# EAGLE design WiFi_RGB_Lights (EAGLE 7.7.0)
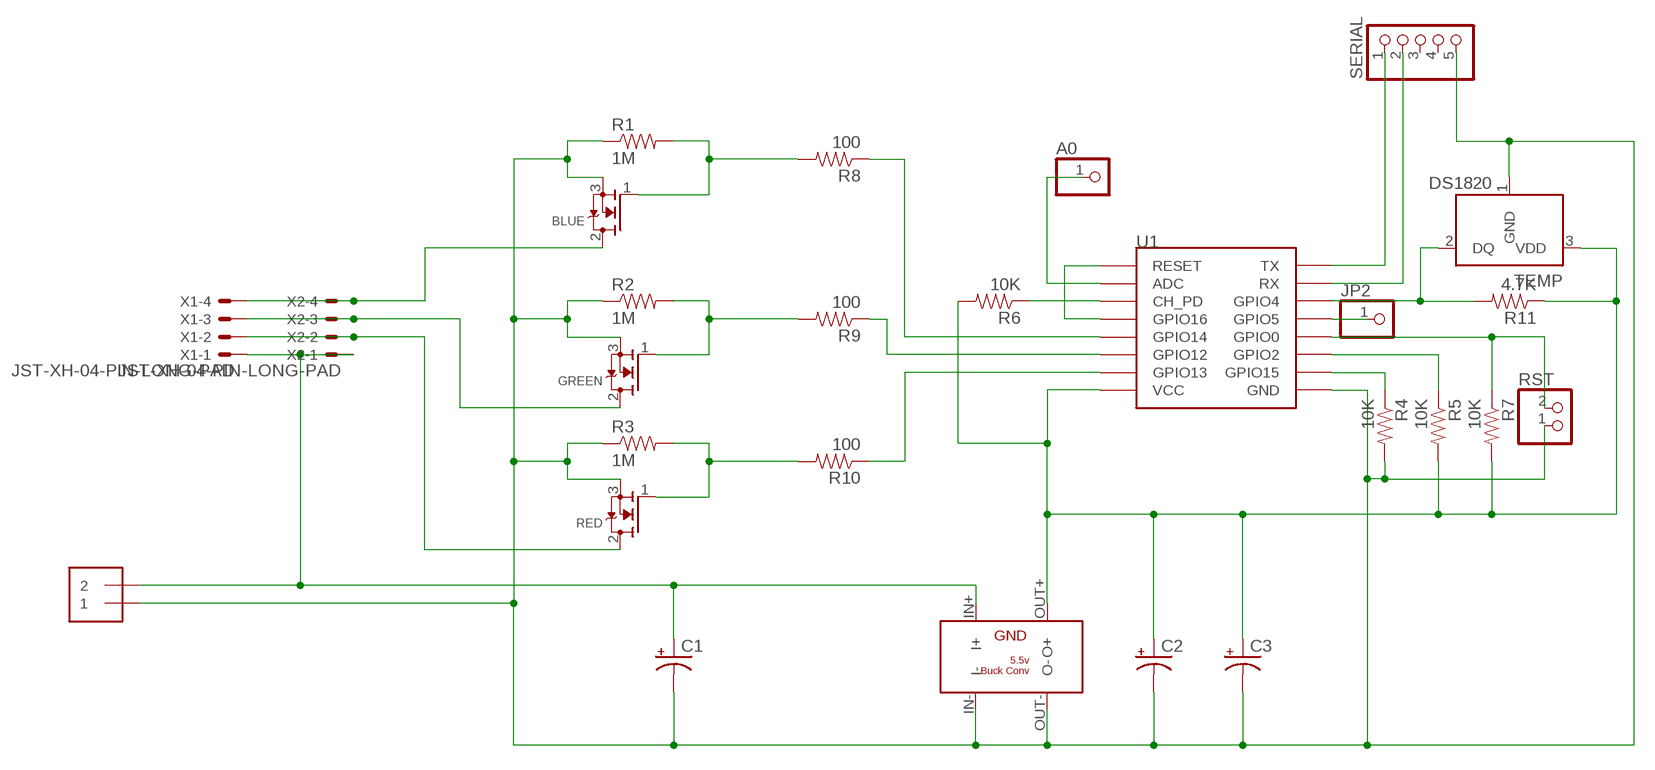
[diagram p0: schematic, sheet 1]

## Parts
3.3V  BUCK_CONV_5.5V  [BUCK_CONV]
A0  PINHD-1X1  [1X01]
BLUE  MOSFET-NGDS_TO220V  [TO220V]
C1  CPOL-USE5-8.5  [E5-8,5]
C2  CPOL-USE2.5-6  [E2,5-6]
C3  CPOL-USE2.5-6  [E2,5-6]
GREEN  MOSFET-NGDS_TO220V  [TO220V]
JP2  PINHD-1X1  [1X01]
PWR  5MM_TERMINAL_BLOCK  [5MM_TERMINAL_BLOCK]
R1  1M  RESISTOR1206  [1206]
R2  1M  RESISTOR1206  [1206]
R3  1M  RESISTOR1206  [1206]
R4  10K  RESISTOR1206  [1206]
R5  10K  RESISTOR1206  [1206]
R6  10K  RESISTOR1206  [1206]
R7  10K  RESISTOR1206  [1206]
R8  100  RESISTOR0805-RES  [0805]
R9  100  RESISTOR0805-RES  [0805]
R10  100  RESISTOR0805-RES  [0805]
R11  4.7K  RESISTOR1206  [1206]
RED  MOSFET-NGDS_TO220V  [TO220V]
RST  JST_2PIN-THM  [JST-PH-2-THM]
SERIAL  PINHD-1X5  [1X05]
TEMP  DS1820  [TO-92]
U1  ESP12  [ESP12]
X1  JST-XH-04-PIN-LONG-PAD  [JST-XH-04-PACKAGE-LONG-PAD]
X2  JST-XH-04-PIN-LONG-PAD  [JST-XH-04-PACKAGE-LONG-PAD]

## Nets
3V: 3.3V.OUT+(O+) C2.+ C3.+ R5.2 R6.2 R7.2 R11.1 TEMP.3(VDD) U1.VCC
12V: 3.3V.IN+(I+) C1.+ PWR.2 X1.1 X2.1
GND: 3.3V.IN-(I-) 3.3V.OUT-(O-) BLUE.3(S) C1.- C2.- C3.- GREEN.3(S) PWR.1 R1.1 R2.1 R3.1 R4.2 RED.3(S) RST.1 SERIAL.5 TEMP.1(GND) U1.GND
N$1: GREEN.1(G) R2.2 R9.2
N$2: U1.GPIO16 U1.RESET
N$3: R6.1 U1.CH_PD
N$4: R10.1 U1.GPIO13
N$5: R9.1 U1.GPIO12
N$6: R8.1 U1.GPIO14
N$7: A0.1 U1.ADC
N$8: R4.1 U1.GPIO15
N$9: BLUE.1(G) R1.2 R8.2
N$10: R5.1 U1.GPIO2
N$11: R7.1 RST.2 U1.GPIO0
N$12: RED.2(D) X1.2 X2.2
N$13: R11.2 TEMP.2(DQ) U1.GPIO4
N$14: JP2.1 U1.GPIO5
N$15: SERIAL.2 U1.RX
N$16: SERIAL.1 U1.TX
N$17: R3.2 R10.2 RED.1(G)
N$19: GREEN.2(D) X1.3 X2.3
N$20: BLUE.2(D) X1.4 X2.4
Unconnected: SERIAL.3 SERIAL.4

## Library data of the parts
3.3V = Jon_SelfMade:BUCK_CONV_5.5V
A0 JP2 = adafruit:PINHD-1X1: Pin header 1x1 for 0.1" spacing With round pins
BLUE GREEN RED = adafruit:MOSFET-N: N-Channel Mosfet 2N7002E - 60V 260mA SOT23 [Digikey: 2N7002ET1GOSTR-ND] - REEL BSH103 - 30V 850mA SOT23 [Digikey: 568-5013-1-ND]
C1-C3 = adafruit:CPOL-US: POLARIZED CAPACITOR, American symbol
PWR = Jon_SelfMade:5MM_TERMINAL_BLOCK
R1-R11 = SparkFun-Passives:RESISTOR: Resistor Basic schematic elements and footprints for 0603, 1206, and PTH resistors.
RST = adafruit:JST_2PIN: JST 2-Pin Connectors of various flavors SMT-RA (S2B-PH-SM4) 4UConnector #17311 SMT (B2B-PH-SM4) THM-RA (S2B-PH) THM (B2B-PH)
SERIAL = pinhead:PINHD-1X5: PIN HEADER
TEMP = DS1820:DS1820: DS1820 - 1-Wire Digital Thermometer
U1 = esp8266modules:ESP12: ESP8266 Wifi module 12
X1 X2 = Rembrandt Electronics - JST XH Connectors v1-0:JST-XH-04-PIN: JST XH Connector 2 Pin Wire to board connector. Pitch: 2,54 mm, (0.100") Number of pins: 4 Created by Rembrandt Electronics www.rembrandtelectronics.com

## Board
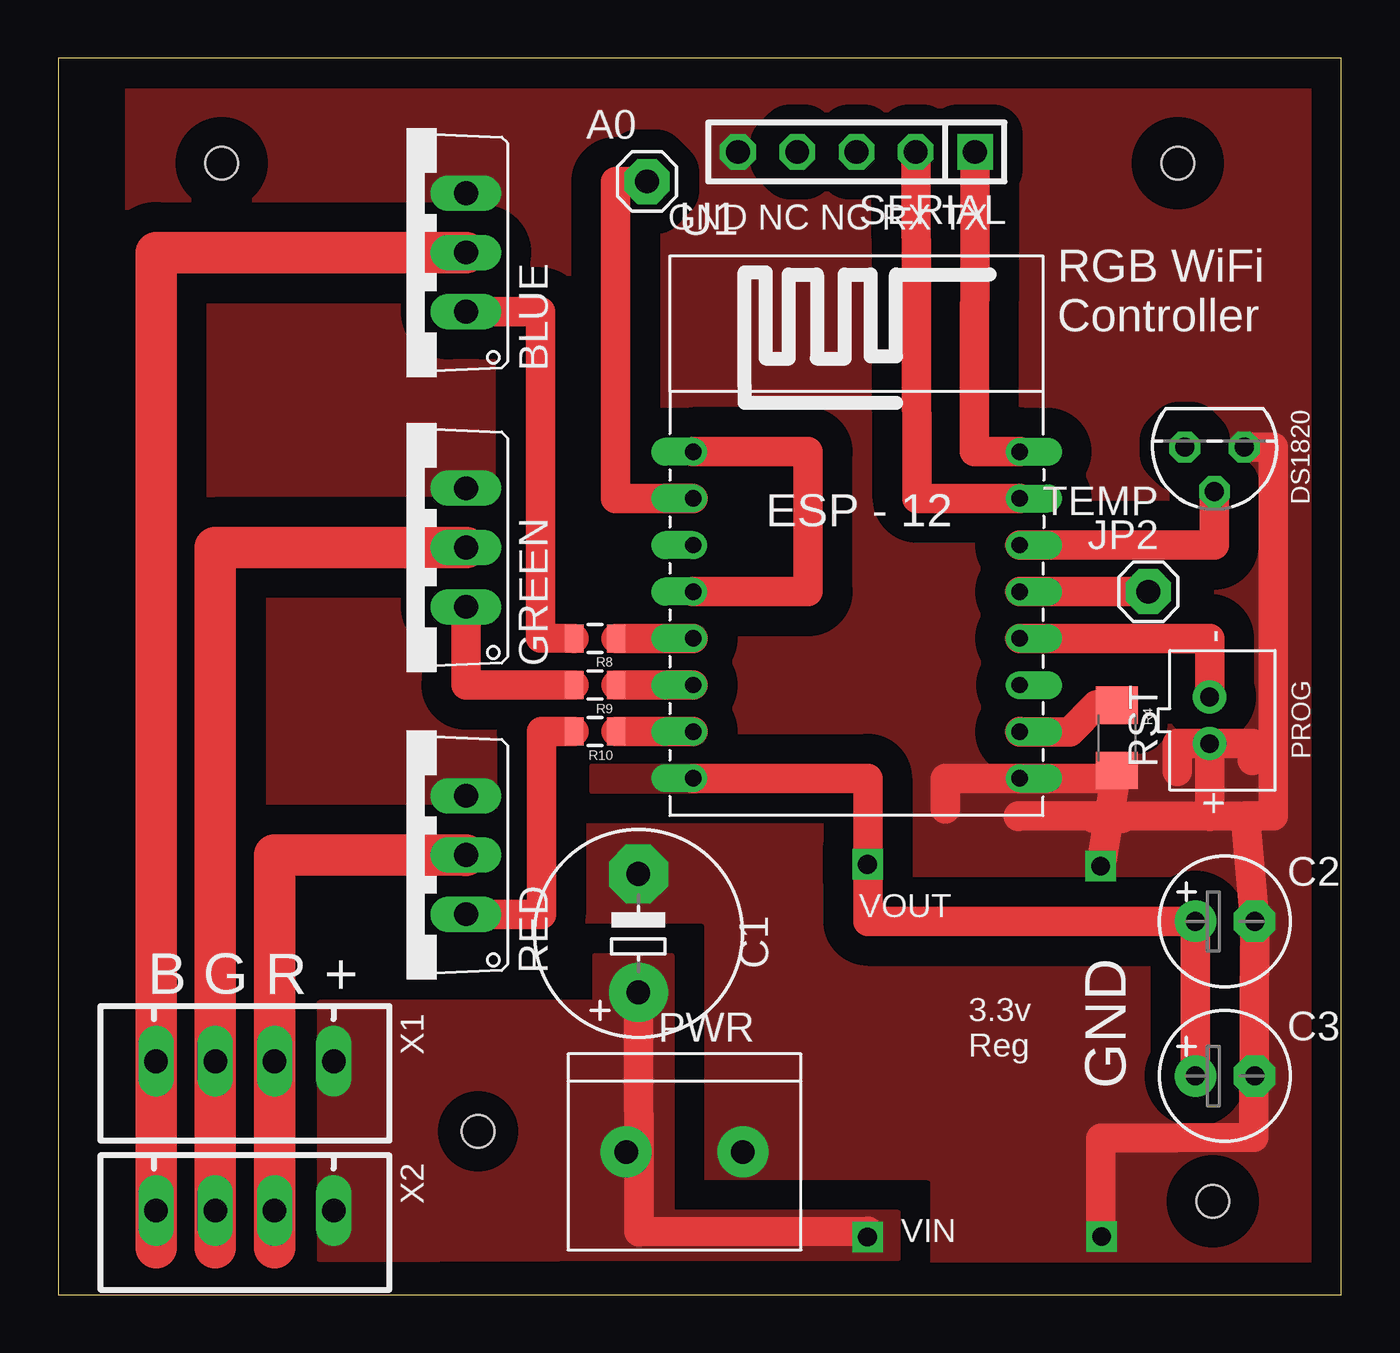
[diagram p1: board, top side]
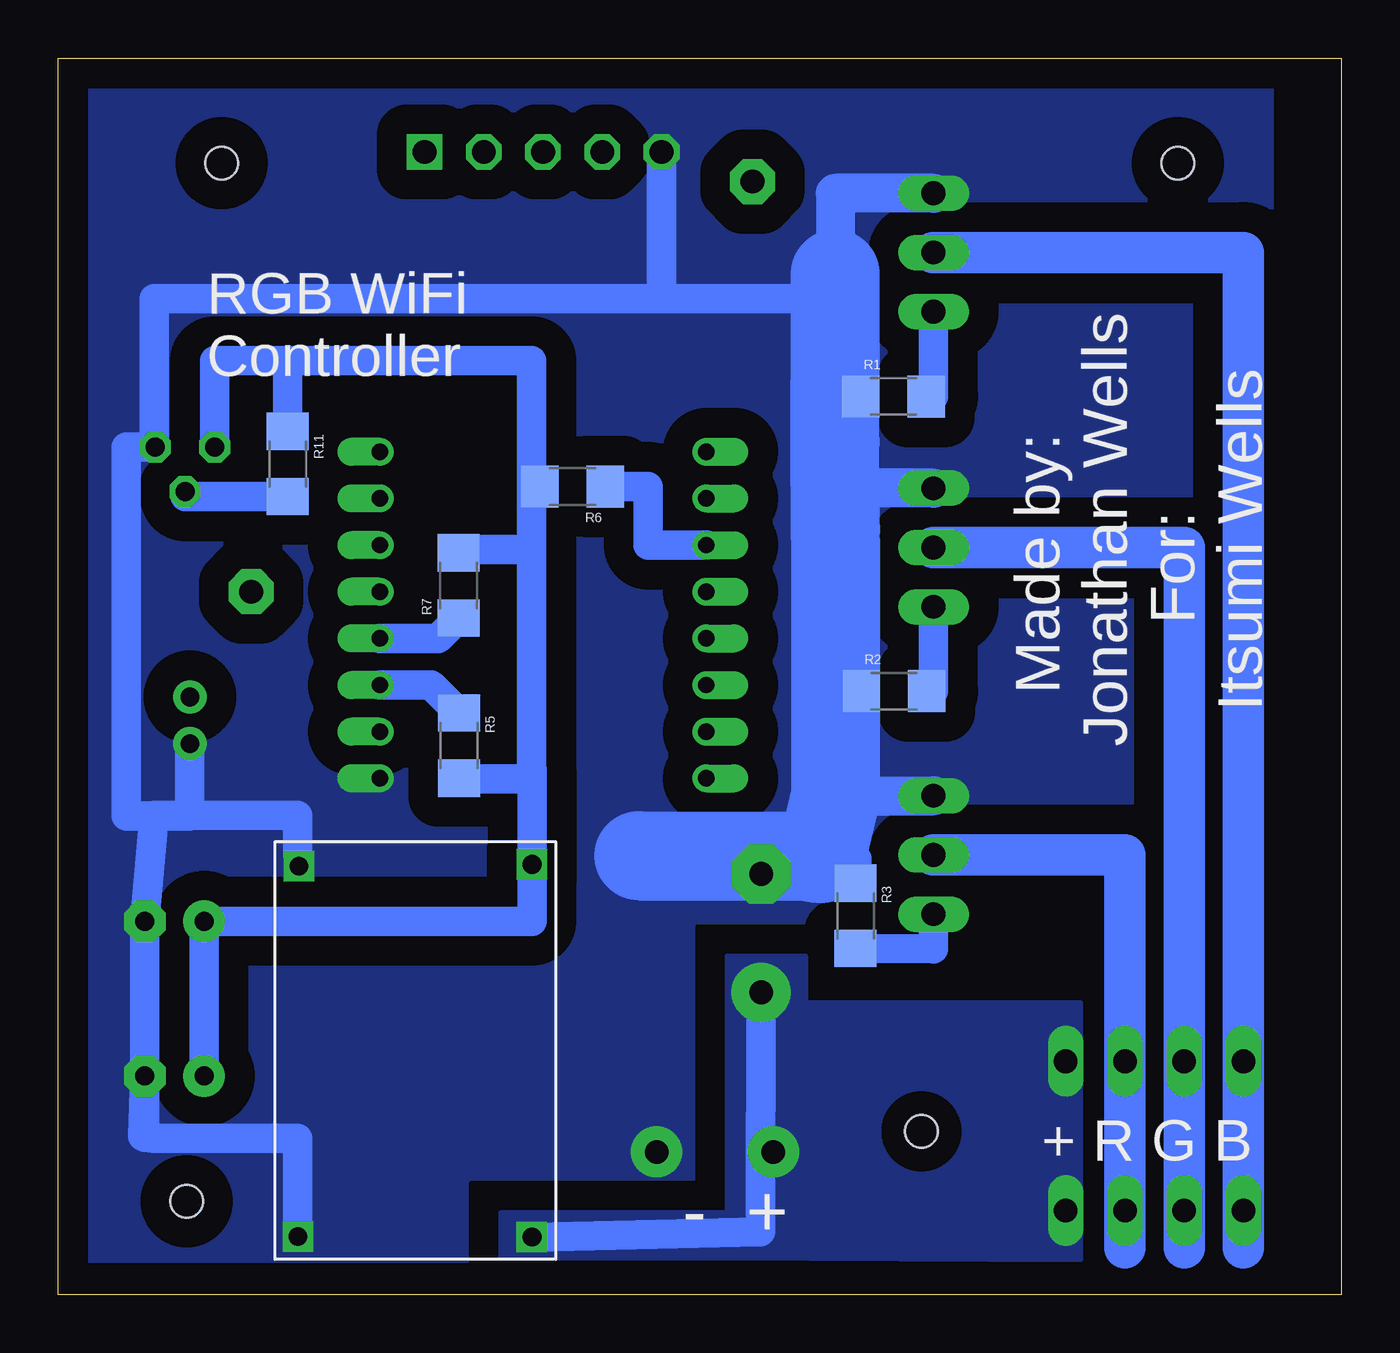
[diagram p2: board, bottom side, seen from below]

Size 55 x 53 mm. Coordinates in mm from the lower left corner, seen from the top.
Outline: 0,0 55,0 55,53 0,53 0,0
Copper layers (1*16): Top 0.035mm / dielectric 1.5mm / Bottom 0.035mm
Design rules "default": minimum track width 10mil, minimum drill 24mil, track to track 8mil, track to pad 8mil, pad to pad 8mil, via to via 8mil, smd to smd 8mil, copper to edge 40mil, drill to drill 8mil, minimum pad ring 10mil, minimum via ring 8mil, stop-mask expansion 4mil, vias tented up to drill 0mil, thermal gap 10mil
Holes 1.4 mm at 49.5,4 48,48.5 7,48.5 18,7

### Footprints (pad centres in the part's own frame; a part is rotated, then mirrored left to right if it is on the bottom)
BUCK_CONV = drill 0.8 square: IN+ -8.04,-5.08; IN- -8.01,4.96; OUT+ 7.94,-5.08; OUT- 7.87,4.91
1X01 = drill 1.016 pad 1.93 octagon: 1 0,0
TO220V = drill 1.016 long: 1 -2.54,-2.54; 2 0,-2.54; 3 2.54,-2.54
E5-8,5 = drill 1.016 pad 2.54: + -2.54,0 | drill 1.016 pad 2.54 octagon: - 2.54,0
E2,5-6 = drill 0.813 pad 1.778: + -1.27,0 | drill 0.813 pad 1.778 octagon: - 1.27,0
5MM_TERMINAL_BLOCK = drill 1 pad 2.184: 1 2.5,0; 2 -2.5,0
1206 = smd 1.6 x 1.8: 1 -1.4,0; 2 1.4,0
0805 = smd 0.8 x 1.2: 1 -0.9,0; 2 0.9,0
JST-PH-2-THM = drill 0.8 pad 1.422: 1 1,0; 2 -1,0
1X05 = drill 1.016 square: 1 -5.08,0 | drill 1.016 octagon: 2 -2.54,0; 3 0,0; 4 2.54,0; 5 5.08,0
TO-92 = drill 0.813 pad 1.27 octagon: 1 -1.27,0; 2 0,1.905; 3 1.27,0
ESP12 = drill 0.7 offset: ADC -7.1,3.8; CH_PD -7.1,1.8; GND 6.9,-8.2; GPIO0 6.9,-2.2; GPIO2 6.9,-4.2; GPIO4 6.9,1.8; GPIO5 6.9,-0.2; GPIO12 -7.1,-4.2; GPIO13 -7.1,-6.2; GPIO14 -7.1,-2.2; GPIO15 6.9,-6.2; GPIO16 -7.1,-0.2; RESET -7.1,5.8; RX 6.9,3.8; TX 6.9,5.8; VCC -7.1,-8.2
JST-XH-04-PACKAGE-LONG-PAD = drill 1.016 long: 1 -3.81,0; 2 -1.27,0; 3 1.27,0; 4 3.81,0

### Placement (x,y rotation side)
3.3V  39.77,10.5 90 bottom
A0  25.24,47.72 0 top
BLUE  14.94,44.67 90 top
C1  24.87,15.49 90 top
C2  50.02,16 0 top
C3  50.02,9.37 0 top
GREEN  14.94,32.02 90 top
JP2  46.73,30.13 0 top
PWR  26.84,6.11 0 top
R1  19.2,38.51 0 bottom
R2  19.17,25.86 0 bottom
R3  20.82,16.24 270 bottom
R4  45.38,23.87 270 top
R5  37.81,23.54 270 bottom
R6  32.95,34.64 180 bottom
R7  37.84,30.4 90 bottom
R8  23.02,28.13 180 top
R9  23.02,26.12 180 top
R10  23.02,24.13 180 top
R11  45.16,35.61 270 bottom
RED  14.94,18.84 90 top
RST  49.36,24.62 270 top
SERIAL  34.22,48.99 180 top
TEMP  49.57,36.33 180 top
U1  34.32,30.33 0 top
X1  8,10 180 top
X2  8,3.6 180 top

### Tracks (layer width: path | path; a pad name or v marks a point on that pad's centre or on a via)
3V
  Top 1.27: U1.VCC 34.7,22.13 34.7,18.69 | C3.+ C2.+ | C2.+ 48.87,16 | C2.+ 34.7,16 34.7,18.69 | 34.7,18.69 3.3V.OUT+
  Bottom 1.27: 34.7,34.41 34.7,31.95 | 34.7,31.95 34.7,22.11 | R6.2 34.35,34.41 34.7,34.41 | R7.2 37.84,31.95 34.7,31.95 | R5.2 37.81,22.11 34.7,22.11 | TEMP.3 48.3,40.03 45.16,40.03 | 45.16,40.03 34.7,40.03 34.7,34.41 | R11.1 45.16,40.03 | 34.7,22.11 34.69,22.52 3.3V.OUT+ 34.69,16 48.88,16 | C3.+ C2.+
  pour Top (no thermals): 27.33,21.58 22.9,21.58 22.9,22.64 27.33,22.64
12V
  Top 1.27: C1.+ 24.91,2.68 34.7,2.71
  Bottom 1.27: C1.+ 24.89,2.68 3.3V.IN+
  pour Top (no thermals): 11.2,1.51 26.63,1.56 36,1.56 36,3.5 26.3,3.5 26.3,14.5 23,14.5 23,12.5 11.2,12.5
  pour Bottom (no thermals): 11.2,1.5 26.66,1.56 36,1.56 36,3.5 26.3,3.5 26.3,14.5 23,14.5 23,12.5 11.2,12.5
GND
  Top 1.27: 49.37,20.49 45.59,20.52 | 45.59,20.52 44.39,20.52 | 44.39,20.52 41.17,20.52 41.17,20.49 | TEMP.1 52.09,36.33 52.09,20.52 50.89,20.52 | 44.39,20.41 44.39,20.52 | RST.1 49.37,20.49 | 45.59,20.41 45.59,20.52 | 3.3V.OUT- 44.74,18.62 R4.2 | 50.89,20.52 49.37,20.49 | 50.89,20.52 C2.- 51.25,6.73 44.69,6.69 44.69,2.75 44.73,2.75 | 45.23,22.54 45.23,22.13 U1.GND 38.04,22.13 38.04,20.81 | RST.1 51.19,23.62 51.19,22.9 | RST.1 47.97,23.62 47.97,22.43
  Bottom 0.254: 21.69,41.91 23.28,41.91 21.8,42.69
  Bottom 1.27: 20.73,40.9 21.8,40.9 21.8,42.69 28.76,42.7 | 28.76,42.7 29.14,42.7 50.89,42.7 50.89,36.33 | R3.1 20.77,18.68 23.07,18.8 | 20.57,31.95 21.67,31.95 | R1.1 21.69,38.51 21.69,36.57 | SERIAL.5 29.14,42.7 28.76,42.7 | 50.89,20.54 C2.- 51.3,6.75 | 50.89,20.54 44.73,20.54 44.73,18.85 | 52.09,20.51 52.09,36.33 50.88,36.33 | 52.09,20.51 50.89,20.54 | 52.09,20.51 49.36,20.51 RST.1 | 3.3V.IN- 44.73,6.69 50.92,6.69 51.3,6.75 | C3.- 51.39,6.79 51.3,6.75
  Bottom 1.676: 21.67,21.39 RED.3 | GREEN.3 21.67,34.56 21.67,32.82 | BLUE.3 21.69,47.22 21.69,41.91
  Bottom 3.81: 30.12,18.81 23.07,18.8 22.3,18.68 21.67,21.39 21.67,31.95 21.67,32.82 21.69,36.57 21.69,41.91 21.69,43.76
  pour Top (isolate 1.27, rank 2, no thermals): 3,52 54.5,52 54.5,1.5 3,1.5
  pour Bottom (isolate 1.27, rank 2, no thermals): 3,52 54.5,52 54.5,1.5 3,1.5
N$1
  Top 1.27: GREEN.1 17.48,26.12 R9.2
  Bottom 1.27: R2.2 17.48,25.86 GREEN.1
N$2
  Top 1.27: U1.GPIO16 32.14,30.13 32.14,36.13 U1.RESET
N$3
  Bottom 1.27: R6.1 29.71,34.64 29.71,32.13 U1.CH_PD
N$4
  Top 1.27: R10.1 U1.GPIO13
N$5
  Top 1.27: R9.1 U1.GPIO12
N$6
  Top 1.27: R8.1 U1.GPIO14
N$7
  Top 1.27: U1.ADC 23.89,34.13 23.89,47.72 A0.1
N$8
  Top 1.27: R4.1 44.51,25.27 43.36,24.12 U1.GPIO15
N$9
  Top 1.27: R8.2 20.68,28.14 20.68,42.13 BLUE.1
  Bottom 1.27: R1.2 17.48,38.51 BLUE.1
N$10
  Bottom 1.27: R5.1 39.01,26.13 U1.GPIO2
N$11
  Top 1.27: U1.GPIO0 44.19,28.13 44.59,28.12 49.36,28.13 RST.2
  Bottom 1.27: R7.1 38.71,28.13 U1.GPIO0
N$12
  Top 1.778: RED.2 9.27,18.84 X1.2 X2.2 9.27,2
  Bottom 1.778: RED.2 9.27,18.84 X1.2 X2.2 9.27,2
N$13
  Top 1.27: U1.GPIO4 49.56,32.13 49.56,33.22 TEMP.2
  Bottom 1.27: TEMP.2 49.57,34.21 R11.2
N$14
  Top 1.27: U1.GPIO5 JP2.1
N$15
  Top 1.27: U1.RX 36.82,34.13 SERIAL.2
N$16
  Top 1.27: U1.TX 39.28,36.13 SERIAL.1
N$17
  Top 1.27: R10.2 20.71,24.13 20.71,16.3 RED.1
  Bottom 1.27: R3.2 17.48,14.82 RED.1
N$19
  Top 1.778: GREEN.2 6.73,32.02 X1.3 X2.3 6.73,2
  Bottom 1.778: GREEN.2 6.73,32.02 X1.3 X2.3 6.73,2
N$20
  Top 1.778: X2.4 X1.4 4.19,44.67 BLUE.2 | X2.4 | X2.4 4.19,2
  Bottom 1.778: BLUE.2 4.19,44.67 X1.4 X2.4 4.19,2

### Text on the board
_tsilk: GND NC NC RX TX | RGB WiFi / Controller | DS1820 | PROG | VOUT | B G R + | 3.3v / Reg | GND | VIN
_bsilk: RGB WiFi / Controller | Made by: / Jonathan Wells / For: / Itsumi Wells | + R G B | + -